# EAGLE design uCurrent (EAGLE 6.1)
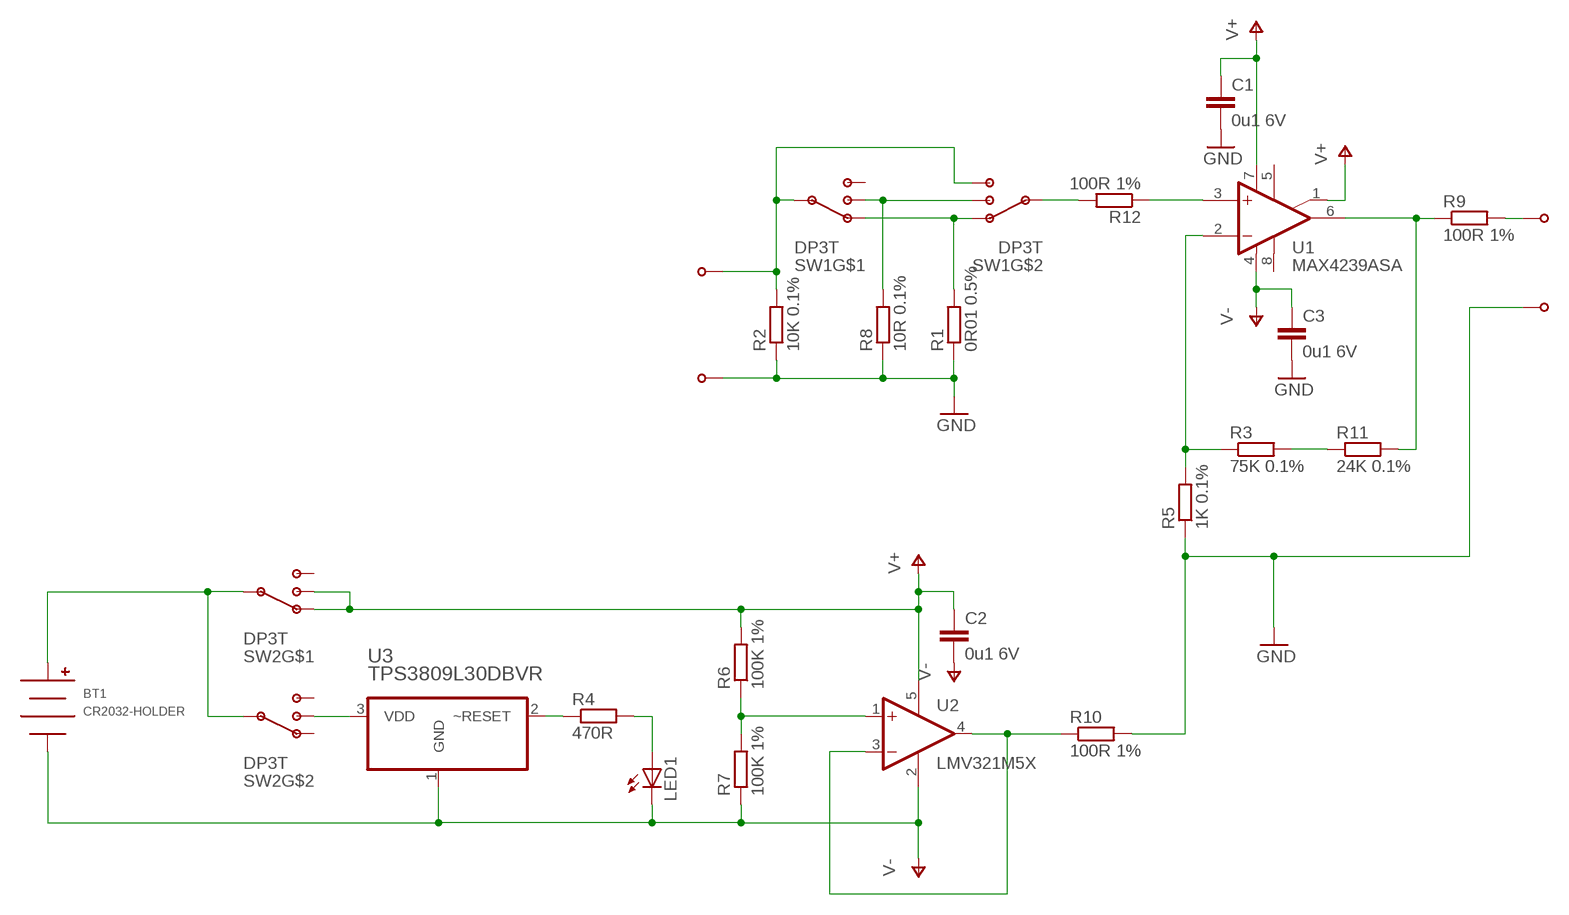
[diagram p0: schematic, sheet 1]

## Parts
BT1  CR2032-HOLDER  [CH28-2032LF]
C1  0u1 6V  C-EUC0805  [C0805]
C2  0u1 6V  C-EUC0805  [C0805]
C3  0u1 6V  C-EUC0805  [C0805]
LED1  LEDCHIPLED_0805  [CHIPLED_0805]
R1  0R01 0.5%  R-EU_R1206  [R1206]
R2  10K 0.1%  R-EU_R0805  [R0805]
R3  75K 0.1%  R-EU_R0805  [R0805]
R4  470R  R-EU_R0805  [R0805]
R5  1K 0.1%  R-EU_R0805  [R0805]
R6  100K 1%  R-EU_R0805  [R0805]
R7  100K 1%  R-EU_R0805  [R0805]
R8  10R 0.1%  R-EU_R0805  [R0805]
R9  100R 1%  R-EU_R0805  [R0805]
R10  100R 1%  R-EU_R0805  [R0805]
R11  24K 0.1%  R-EU_R0805  [R0805]
R12  100R 1%  R-EU_R0805  [R0805]
SW1  DP3T  [DP3T]
SW2  DP3T  [DP3T]
U1  MAX4239ASA  [SO08]
U2  LMV321M5X  [SOT23-5]
U3  TPS3809L30DBVR  [SOT95P280X145-3N]
U$2  BANANA-JACK  [BANANA-PRINT]
U$3  BANANA-JACK  [BANANA-PRINT]
U$4  BANANA-JACK  [BANANA-PRINT]
U$5  BANANA-JACK  [BANANA-PRINT]

## Nets
GND: C1.2 C3.2 R1.1 R2.1 R5.1 R8.1 R10.2 U$3.P$1(PIN) U$5.P$1(PIN)
N$1: R10.1 U2.3(-IN) U2.4(OUT)
N$2: R2.2 SW1.P$4 SW1.P$C1(C) U$2.P$1(PIN)
N$3: R8.2 SW1.P$2 SW1.P$5
N$4: R1.2 SW1.P$3 SW1.P$6
N$5: R3.2 R11.1
N$6: R3.1 R5.2 U1.2(-IN)
N$7: R12.2 SW1.P$C2(C)
N$8: R9.1 R11.2 U1.6(OUT)
N$9: R12.1 U1.3(+IN)
N$10: R6.1 R7.2 U2.1(+IN)
N$11: R4.1 U3.2(~RESET)
N$12: LED1.A R4.2
N$13: SW2.P$5 U3.3(VDD)
N$14: BT1.POS SW2.P$C1(C) SW2.P$C2(C)
N$15: R9.2 U$4.P$1(PIN)
V+: C1.1 C2.1 R6.2 SW2.P$2 SW2.P$3 U1.1(NC) U1.7(V+) U2.5(V+)
V-: BT1.NEG C2.2 C3.1 LED1.C R7.1 U1.4(V-) U2.2(V-) U3.1(GND)
Unconnected: SW1.P$1 SW2.P$1 SW2.P$4 SW2.P$6 U1.5(NC) U1.8(NC)

## Library data of the parts
BT1 = cr2032-holder:CR2032-HOLDER
C1-C3 = rcl:C-EU: CAPACITOR, European symbol
LED1 = led:LED: LED OSRAM: - CHIPLED LG R971, LG N971, LY N971, LG Q971, LY Q971, LO R971, LY R971 LH N974, LH R974 LS Q976, LO Q976, LY Q976 LO Q996 - Hyper CHIPLED LW Q18S LB Q993, LB Q99A, LB R99A - SideLED LS A670, LO A670, LY A670, LG A670, LP A670 LB A673, LV A673, LT A673, LW A673 LH A674 LY A675 LS A676, LA A676, LO A676, LY A676, LW A676 LS A679, LY A679, LG A679 - Hyper Micro SIDELED® LS Y876, LA Y876, LO Y876, LY Y876 LT Y87S - SmartLED LW L88C, LW L88S LB L89C, LB L89S, LG L890 LS L89K, LO L89K, LY L89K LS L896, LA L896, LO L896, LY L896 - TOPLED LS T670, LO T670, LY T670, LG T670, LP T670 LSG T670, LSP T670, LSY T670, LOP T670, LYG T670 LG T671, LOG T671, LSG T671 LB T673, LV T673, LT T673, LW T673 LH T674 LS T676, LA T676, LO T676, LY T676, LB T676, LH T676, LSB T676, LW T676 LB T67C, LV T67C, LT T67C, LS T67K, LO T67K, LY T67K, LW E67C LS E67B, LA E67B, LO E67B, LY E67B, LB E67C, LV E67C, LT E67C LW T67C LS T679, LY T679, LG T679 LS T770, LO T770, LY T770, LG T770, LP T770 LB T773, LV T773, LT T773, LW T773 LH T774 LS E675, LA E675, LY E675, LS T675 LS T776, LA T776, LO T776, LY T776, LB T776 LHGB T686 LT T68C, LB T68C - Hyper Mini TOPLED® LB M676 - Mini TOPLED Santana® LG M470 LS M47K, LO M47K, LY M47K Source: http://www.osram.convergy.de LUXEON: - LUMILED® LXK2-PW12-R00, LXK2-PW12-S00, LXK2-PW14-U00, LXK2-PW14-V00 LXK2-PM12-R00, LXK2-PM12-S00, LXK2-PM14-U00 LXK2-PE12-Q00, LXK2-PE12-R00, LXK2-PE12-S00, LXK2-PE14-T00, LXK2-PE14-U00 LXK2-PB12-K00, LXK2-PB12-L00, LXK2-PB12-M00, LXK2-PB14-N00, LXK2-PB14-P00, LXK2-PB14-Q00 LXK2-PR12-L00, LXK2-PR12-M00, LXK2-PR14-Q00, LXK2-PR14-R00 LXK2-PD12-Q00, LXK2-PD12-R00, LXK2-PD12-S00 LXK2-PH12-R00, LXK2-PH12-S00 LXK2-PL12-P00, LXK2-PL12-Q00, LXK2-PL12-R00 Source: www.luxeon.com KINGBRIGHT: KA-3528ASYC Source: www.kingbright.com
R1-R12 = rcl:R-EU_: RESISTOR, European symbol
SW1 SW2 = switch-ck-ayz:DP3T: C&K - AYZ Series Miniature Slide Switches
U1 = maxim-ucurrent:MAX4239ASA
U2 = linear:LMV321?*: General Purpose, Low Voltage, Rail-to-Rail Output Operational Amplifiers Source: http://www.national.com/mpf/LM/LMV321.html http://www.national.com/dt/lmv_qual.pdf
U3 = TPS3809:TPS3809L30DBVR: VOLTAGE SUPERVISORS; MPN: TPS3809L30DBVR; OC_FARNELL: 1535757; OC_NEWARK: 77C0403; PACKAGE: SOT23-3; SUPPLIER: Texas Instruments
U$2-U$5 = con-banana:BANANA-JACK

## Board
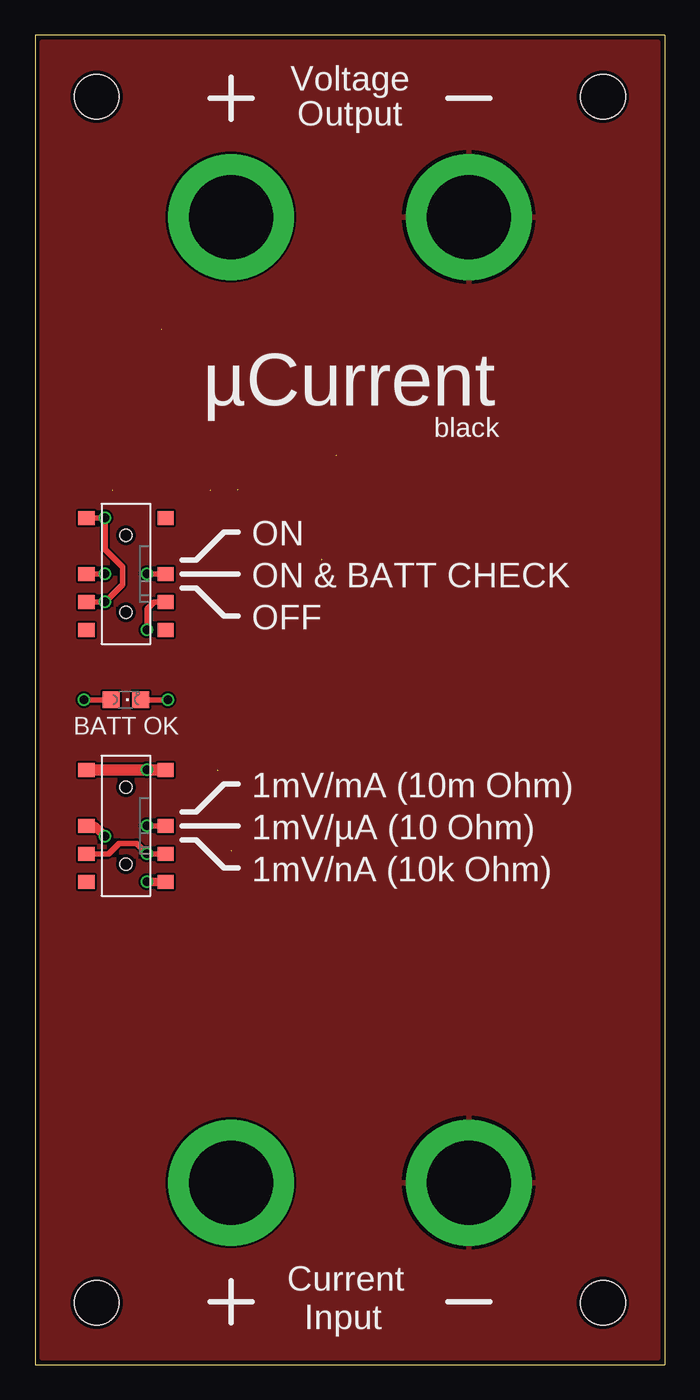
[diagram p1: board, top side]
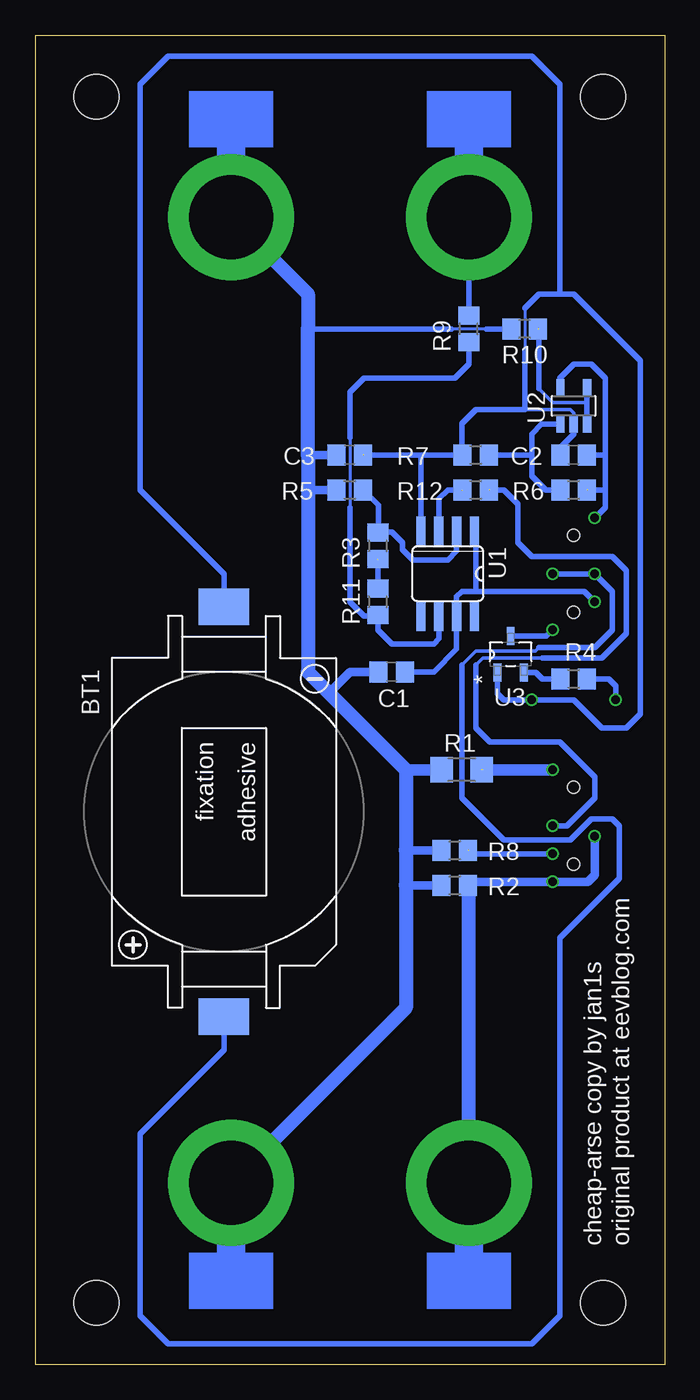
[diagram p2: board, bottom side, seen from below]

Size 45 x 95 mm. Coordinates in mm from the lower left corner, seen from the top.
Outline: 0,0 45,0 45,95 0,95 0,0
Copper layers (1*16): Top 0.035mm / dielectric 1.5mm / Bottom 0.035mm
Design rules: minimum track width 6mil, minimum drill 12mil, track to track 6mil, track to pad 6mil, pad to pad 6mil, via to via 6mil, smd to smd 0mil, copper to edge 10mil, drill to drill 10mil, minimum pad ring 10mil, minimum via ring 6mil, stop-mask expansion 2mil, vias tented up to drill 100mil, thermal gap 10mil
Holes 3.2 mm at 4.4,4.4 40.6,4.4 4.4,90.6 40.6,90.6

### Footprints (pad centres in the part's own frame; a part is rotated, then mirrored left to right if it is on the bottom)
CH28-2032LF = smd 3.6 x 2.6: NEG 0,-14.65; POS 0,14.65
C0805 = smd 1.3 x 1.5: 1 -0.95,0; 2 0.95,0
CHIPLED_0805 = smd 1.2 x 1.2: A 0,-1.05; C 0,1.05
R1206 = smd 1.6 x 1.803: 1 -1.422,0; 2 1.422,0
R0805 = smd 1.3 x 1.5: 1 -0.95,0; 2 0.95,0
DP3T = smd 1 x 1.15: P$1 -4,2.825; P$2 -2,2.825; P$3 4,2.825; P$4 -4,-2.825; P$5 -2,-2.825; P$6 4,-2.825; P$C1 0,2.825; P$C2 0,-2.825 | hole 0.85: -2.75,0; 2.75,0
SO08 = smd 0.66 x 2.032: 1 -1.905,-3.073; 2 -0.635,-3.073; 3 0.635,-3.073; 4 1.905,-3.073; 5 1.905,3.073; 6 0.635,3.073; 7 -0.635,3.073; 8 -1.905,3.073
SOT23-5 = smd 0.6 x 1.2: 1 -0.95,-1.306; 2 0,-1.306; 3 0.95,-1.306; 4 0.95,1.306; 5 -0.95,1.306
SOT95P280X145-3N = smd 1.27 x 0.559: 1 -1.295,0.94; 2 -1.295,-0.94; 3 1.295,0
BANANA-PRINT = drill 6 pad 9: P$1 0,0

### Placement (x,y rotation side)
BT1  31.5,39.5 180 bottom
C1  19.5,49.5 180 bottom
C2  6.5,65 180 bottom
C3  22.5,65 180 bottom
LED1  6.5,47.5 270 top
R1  14.5,42.5 0 bottom
R2  15,34.25 0 bottom
R3  20.5,58.5 270 bottom
R4  6.5,49 0 bottom
R5  22.5,62.5 0 bottom
R6  6.5,62.5 0 bottom
R7  13.5,65 0 bottom
R8  15,36.75 0 bottom
R9  14,74 90 bottom
R10  10,74 180 bottom
R11  20.5,54.5 270 bottom
R12  13.5,62.5 0 bottom
SW1  6.5,38.5 90 top
SW2  6.5,56.5 90 top
U1  15.5,56.5 180 bottom
U2  6.5,68.5 0 bottom
U3  11,50.75 90 bottom
U$2  14,13 180 bottom
U$3  31,13 180 bottom
U$4  14,82 0 bottom
U$5  31,82 0 bottom

### Tracks (layer width: path | path; a pad name or v marks a point on that pad's centre or on a via)
GND
  Bottom 0.2: 12.75,74 15.25,74
  Bottom 0.406: R10.2 12.75,74 | 15.25,74 25.5,74
  Bottom 0.61: C3.2 25.5,65 | R5.1 25.5,62.5 | C1.2 22.5,49.5 24,48 | R2.1 18.5,34.25 | R8.1 18.5,36.75
  Bottom 0.813: R1.1 18.5,42.5
  Bottom 1.016: U$5.P$1 25.5,76.5 25.5,74 25.5,65 25.5,62.5 25.5,49.5 24,48 18.5,42.5 18.5,36.75 18.5,34.25 18.5,25.5 U$3.P$1
  pour Top: 0.5,0.5 44.5,0.5 44.5,94.5 0.5,94.5
N$1  (1 unrouted)
  Bottom 0.2: 5.75,68.75 5.5,68.5 5.55,68.5
  Bottom 0.254: 5.75,68.75 8,68.75 9,69.75
  Bottom 0.406: U2.3 5.55,68.5 U2.4 5.55,68.55 | 9,69.75 9,74
N$2  (via drill 0.6)
  Top 0.61: SW1.P$4 v8,34.5 | SW1.P$C1 4.25,38.5 v5,37.75
  Bottom 0.406: 13.8,34.5 R2.2 14,34.2
  Bottom 0.61: v5,37.75 5,35 5.5,34.5 v8,34.5 13.8,34.5
  Bottom 1.016: U$2.P$1 14,34.2
N$3  (via drill 0.6)  (1 unrouted)
  Top 0.406: SW1.P$2 5.25,36.5 6,37.25 7.25,37.25 v8,36.5 SW1.P$5
  Bottom 0.406: v8,36.5 13.75,36.5 14,36.75
N$4  (via drill 0.6)  (1 unrouted)
  Top 0.406: SW1.P$6 v8,42.5
  Top 0.813: SW1.P$3 SW1.P$6
  Bottom 0.813: v8,42.5 13,42.5
N$5  (1 unrouted)
  Bottom 0.406: R11.1 20.5,57.5
N$6
  Bottom 0.406: U1.2 14.86,58.13 15.5,57.5 18,57.5 18.75,58.25 18.75,58.75 19.5,59.5 20.45,59.5 | 20.45,59.5 R3.1 | 20.45,59.5 20.45,61.4 R5.2
N$7  (via drill 0.6)  (1 unrouted)
  Top 0.406: SW1.P$C2 v8,38.5
  Bottom 0.254: 13.5,50 13,50.5 8.75,50.5
  Bottom 0.406: v8,38.5 7,38.5 5,40.5 5,42 7.5,44.5 12.5,44.5 13.5,45.5 13.5,50 | 8.75,50.5 4.5,50.5 2.75,52.25 2.75,56.75 3.75,57.75 9.5,57.75 10.5,58.75 10.5,61.5 11.5,62.5 12.5,62.5
N$8
  Bottom 0.2: 22.5,66.25 22.5,61.25
  Bottom 0.406: U1.6 16.14,51.87 16.5,51.5 19.5,51.5 20.5,52.5 R11.2 20.55,53.5 21.5,53.5 22.5,54.5 22.5,61.25 | R9.1 14,71.5 15,70.5 21.5,70.5 22.5,69.5 22.5,66.25
N$9  (1 unrouted)
  Bottom 0.406: U1.3 16.14,61.86 15.5,62.5 14.5,62.5
N$10
  Bottom 0.406: U2.1 8.81,67.19 9.5,66.5 9.5,65 | 9.5,65 9.5,63.5 8.5,62.5 R6.1 | R7.2 9.5,65
N$11
  Bottom 0.406: R4.1 8.75,49 9.21,49.45 U3.2
N$12  (via drill 0.6)
  Top 0.406: v3.5,47.5 LED1.A
  Bottom 0.406: R4.2 4,49 3.5,48.5 v3.5,47.5
N$13  (via drill 0.6)
  Top 0.406: SW2.P$5 8.5,54.5 8,54 v8,52.5
  Bottom 0.406: U3.3 8.46,52.05 v8,52.5
N$14  (via drill 0.6)
  Top 0.406: SW2.P$C2 v8,56.5 | SW2.P$C1 v5,56.5
  Bottom 0.254: 14.5,50 13.5,51 9.25,51 9,51.25
  Bottom 0.406: v8,56.5 v5,56.5 3.75,55.25 3.75,52.5 5,51.25 9,51.25 | BT1.POS 31.5,22.5 37.5,16.5 37.5,3.5 35.5,1.5 9.5,1.5 7.5,3.5 7.5,30.5 3.25,34.75 3.25,38.5 3.75,39 5.25,39 6.75,37.5 11.5,37.5 14.5,40.5 14.5,50
N$15
  Bottom 0.406: U$4.P$1 R9.2
V+  (via drill 0.6)  (1 unrouted)
  Top 0.406: SW2.P$2 v5,54.5 6.25,55.75 6.25,57 5,58.25 v5,60.5 SW2.P$3
  Bottom 0.406: C1.1 16.5,49.5 14.86,51.13 U1.7 14.86,54.88 14.5,55.25 13.5,55.25 | 4.25,65 4.25,70.5 5.25,71.5 6.5,71.5 7.5,70.5 7.45,70.45 U2.5 | C2.1 4.25,65 | 13.5,55.25 5.75,55.25 v5,54.5 | 4.25,65 4.25,62.5 | 4.25,62.5 5.5,62.5 | v5,60.5 4.25,61.25 4.25,62.5 | U1.1 13.5,59.57 13.5,55.25
V-  (via drill 0.6)  (1 unrouted)
  Top 0.406: LED1.C v9.5,47.5
  Bottom 0.2: 10,75.5 10,72.5
  Bottom 0.254: 6.5,66.5 6.5,68 6.75,68.25 10,68.25
  Bottom 0.406: U1.4 17.41,64.91 17.5,65 | U2.2 6.5,66.5 7.5,65.5 7.45,65.45 C2.2 | 7.5,76.5 6.5,76.5 1.75,71.75 1.75,46.5 2.75,45.5 4.5,45.5 6.5,47.5 v9.5,47.5 11.5,47.5 11.94,47.94 U3.1 | 7.5,76.5 9,76.5 10,75.5 | 10,72.5 10,68.25 13.5,68.25 14.5,67.25 14.5,65 | R7.1 14.5,65 | 14.5,65 17.5,65 | 17.5,65 21.5,65 | BT1.NEG 31.5,56.5 37.5,62.5 37.5,91.5 35.5,93.5 9.5,93.5 7.5,91.5 7.5,76.5

### Text on the board
tNames: Voltage | Output | µCurrent | black | ON | ON & BATT CHECK | OFF | BATT OK | 1mV/mA (10m Ohm) | 1mV/µA (10 Ohm) | 1mV/nA (10k Ohm) | Current | Input
bNames: original product at eevblog.com | cheap-arse copy by jan1s